# EasyEDA schematic SCH_pcb555_2024-04-26.json
TITLE: PCB_555_LED_chaser; REV: 1.0; Date: 2024-04-22; Sheet: 1/1; Drawn By: dimir; Company: Your Company
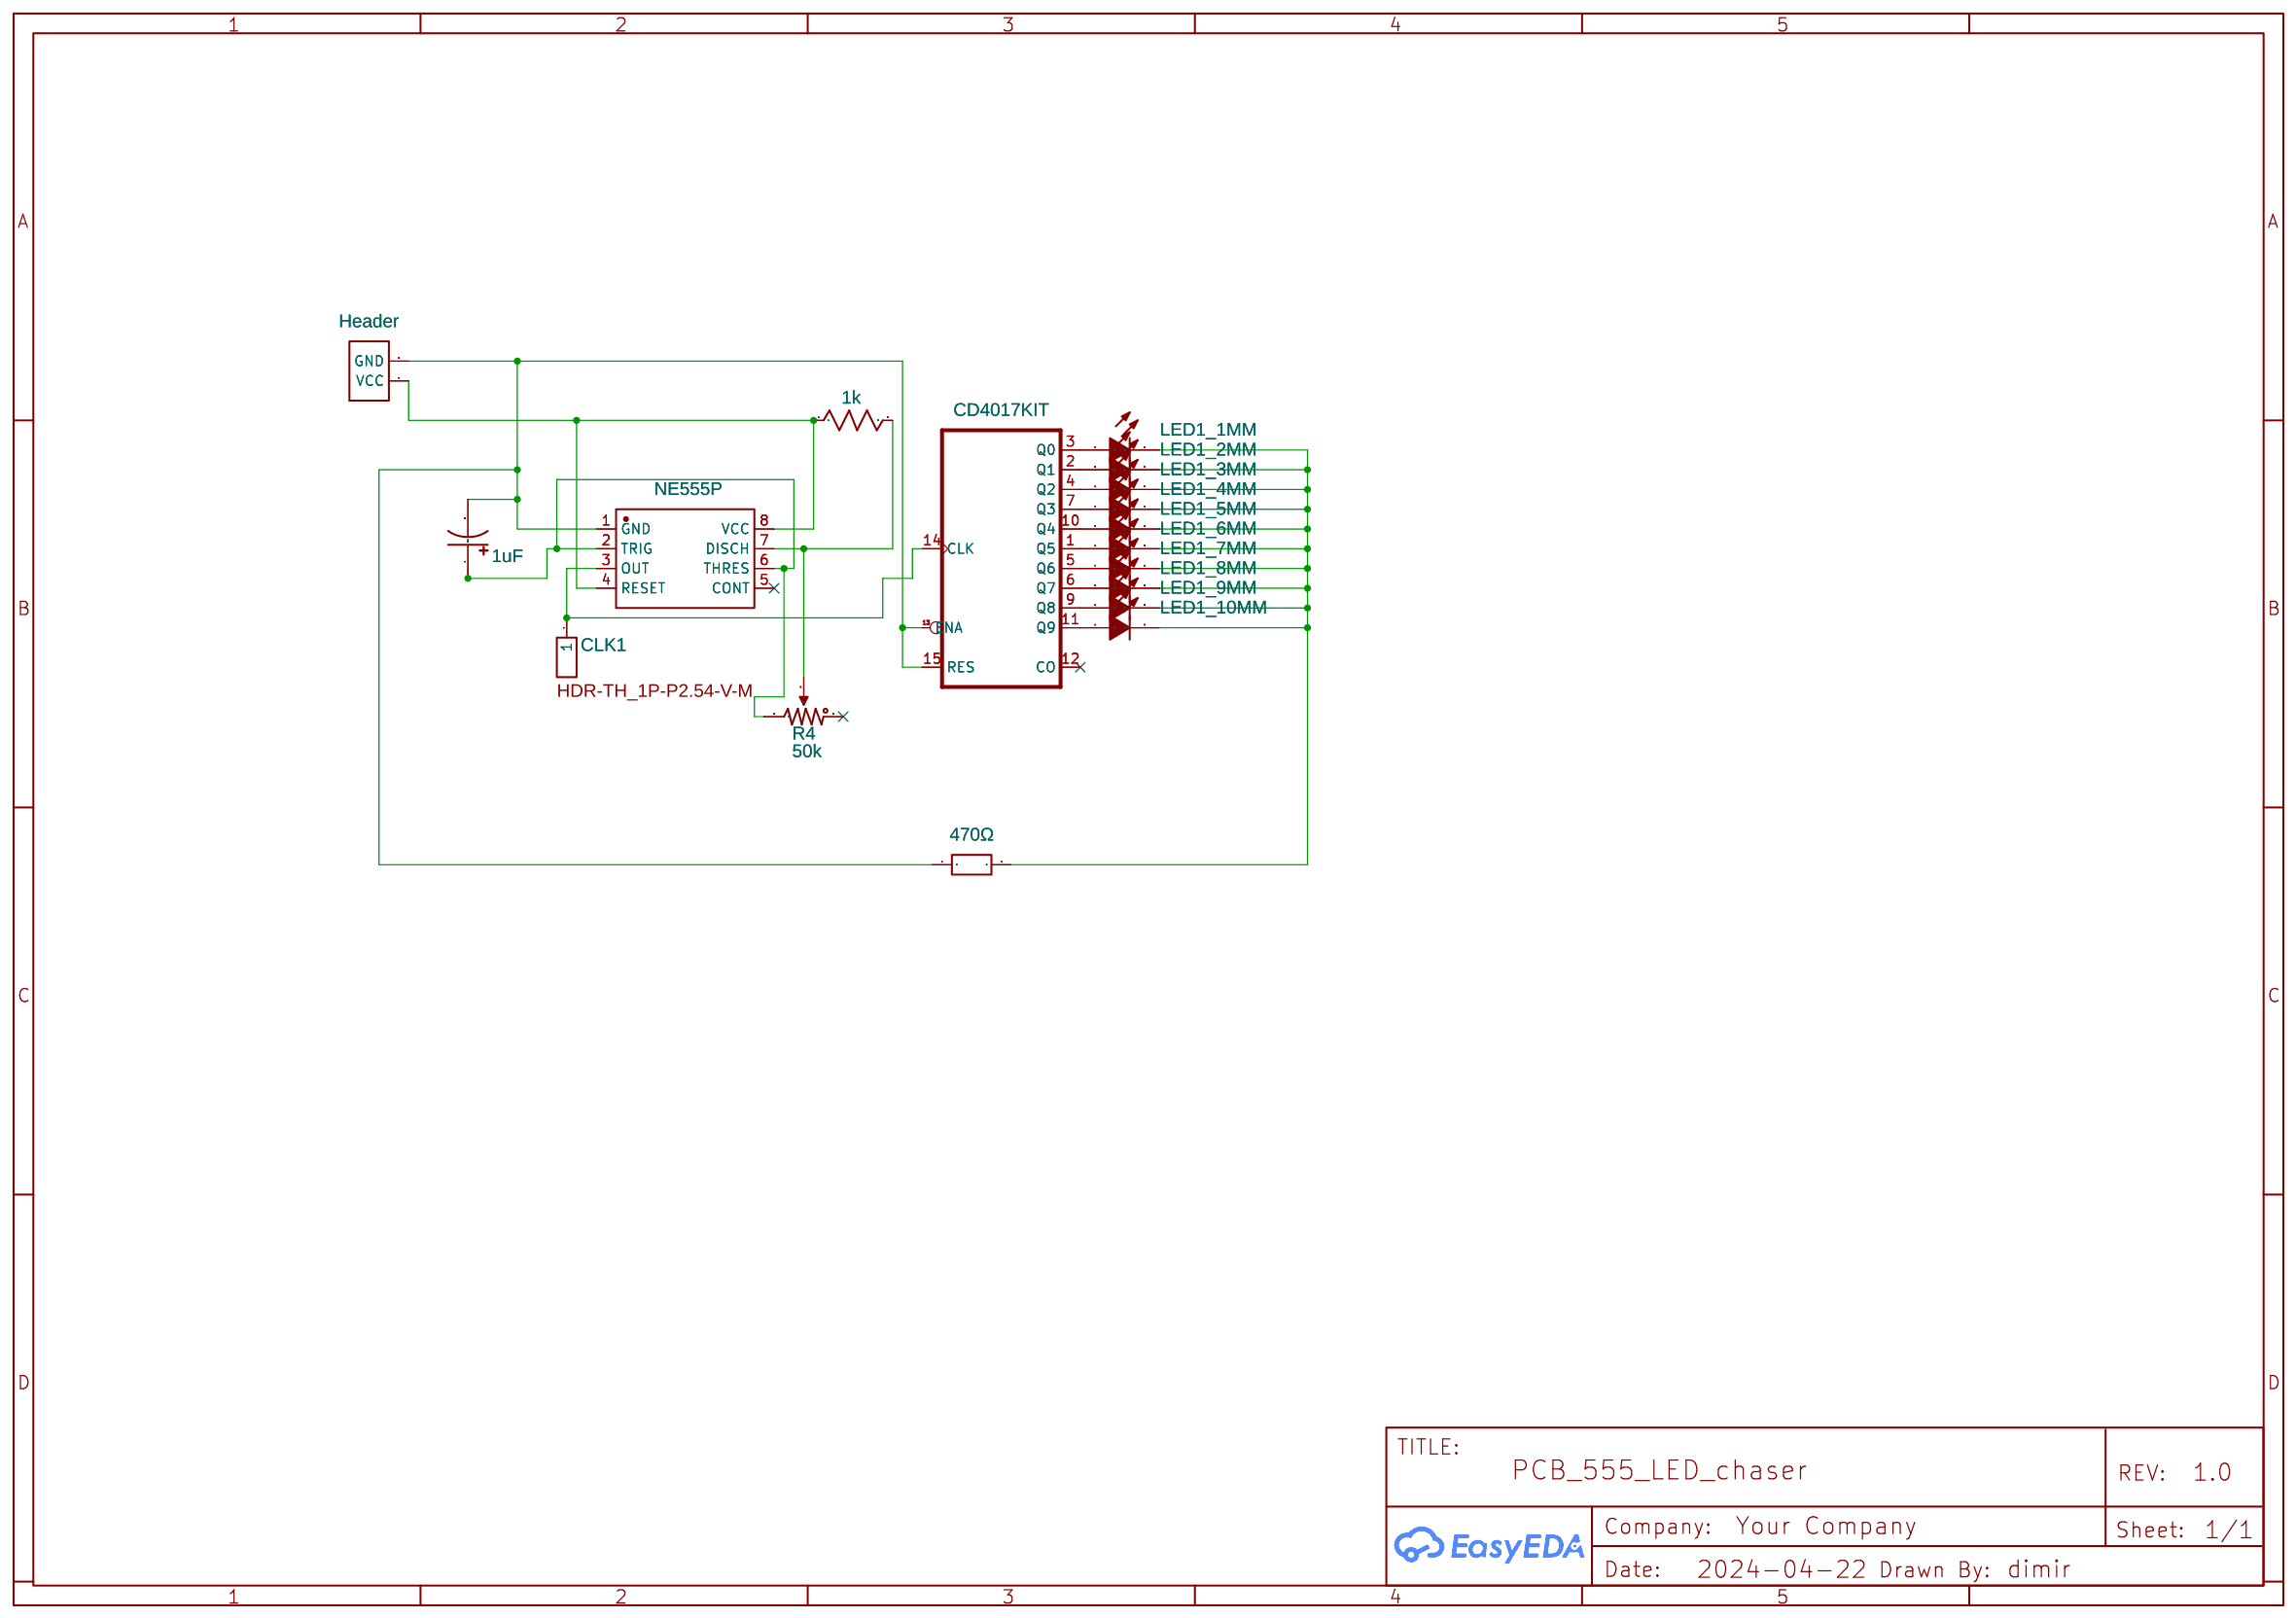
[diagram p0: schematic sheet]

## Parts
C1  1uF  [CAP-TH_BD5.0-P2.00-D0.8-FD]
CLK1  C81276  [HDR-TH_1P-P2.54-V-M]
H1  Header  [HEADER-FEMALE-2.54_1X2]
LED1_1MM  LED_5MM  [LED-TH_BD5.0-P2.54-FD_C9900023552]
LED1_2MM  LED_5MM  [LED-TH_BD5.0-P2.54-FD_C9900023552]
LED1_3MM  LED_5MM  [LED-TH_BD5.0-P2.54-FD_C9900023552]
LED1_4MM  LED_5MM  [LED-TH_BD5.0-P2.54-FD_C9900023552]
LED1_5MM  LED_5MM  [LED-TH_BD5.0-P2.54-FD_C9900023552]
LED1_6MM  LED_5MM  [LED-TH_BD5.0-P2.54-FD_C9900023552]
LED1_7MM  LED_5MM  [LED-TH_BD5.0-P2.54-FD_C9900023552]
LED1_8MM  LED_5MM  [LED-TH_BD5.0-P2.54-FD_C9900023552]
LED1_9MM  LED_5MM  [LED-TH_BD5.0-P2.54-FD_C9900023552]
LED1_10MM  LED_5MM  [LED-TH_BD5.0-P2.54-FD_C9900023552]
R2  1k  [AXIAL-0.3]
R4  50k  [RES-ADJ_3296X]
U1  CD4017KIT  [DIL16-KIT]  (section 1)
U2  NE555P  [DIP-8_L9.8-W6.6-P2.54-LS7.6-BL]
U3  470Ω  [RES-TH_BD3.3-L9.0-P13.00-D0.6]

## Library data of the parts
C1 = UVZ1H010MDD: Contributor: LCSC; Supplier: LCSC; Supplier Part: C62934; Manufacturer: Nichicon(尼吉康)
CLK1 = Header-Male-2.54_1x1: Supplier: LCSC; Manufacturer Part: 2.54-1*1P针; JLCPCB Part Class: Extended Part; Package Display: Yes; Manufacturer: BOOMELE(Boom Precision Elec); Contributor: Thejo Prakash
H1 = HEADER-FEMALE-2.54_1X2: Contributor: nonstop2004; Supplier Part: C492401; Supplier: LCSC
LED1_1MM LED1_2MM LED1_3MM LED1_4MM LED1_5MM LED1_6MM LED1_7MM LED1_8MM LED1_9MM LED1_10MM = LED_5MM: Contributor: lcsc; Supplier: LCSC; Supplier Part: C2992663
R2 = Resistor: Manufacturer Part: ?; Supplier Part: C713997; Supplier: LCSC
R4 = Potentiometer: K(%): 50; Manufacturer Part: ?; Supplier Part: C118912; Supplier: LCSC
U1 = CD4017KIT: Contributor: SparkFun; Supplier Part: C34519
U2 = NE555P: Supplier: LCSC; Manufacturer: TI(德州仪器); Supplier Part: C46749; JLCPCB Part Class: Extended Part
U3 = RSF-50JT-52-470R: Contributor: lcsc; Supplier: LCSC; Supplier Part: C58592; Manufacturer: YAGEO(国巨)

## Nets
Net-(C1-1): C1.1 R4.1 U2.2(TRIG) U2.6(THRES)
Net-(C1-2): C1.2 H1.2(GND) U1.13(ENA) U1.15(RES) U2.1(GND) U3.1
Net-(CLK1-1): CLK1.1 U1.14(CLK) U2.3(OUT)
Net-(H1-1): H1.1(VCC) R2.1 U2.4(RESET) U2.8(VCC)
Net-(LED1_1MM-1): LED1_1MM.1(A) U1.3(Q0)
Net-(LED1_1MM-2): LED1_1MM.2(K) LED1_2MM.2(K) LED1_3MM.2(K) LED1_4MM.2(K) LED1_5MM.2(K) LED1_6MM.2(K) LED1_7MM.2(K) LED1_8MM.2(K) LED1_9MM.2(K) LED1_10MM.2(K) U3.2
Net-(LED1_2MM-1): LED1_2MM.1(A) U1.2(Q1)
Net-(LED1_3MM-1): LED1_3MM.1(A) U1.4(Q2)
Net-(LED1_4MM-1): LED1_4MM.1(A) U1.7(Q3)
Net-(LED1_5MM-1): LED1_5MM.1(A) U1.10(Q4)
Net-(LED1_6MM-1): LED1_6MM.1(A) U1.1(Q5)
Net-(LED1_7MM-1): LED1_7MM.1(A) U1.5(Q6)
Net-(LED1_8MM-1): LED1_8MM.1(A) U1.6(Q7)
Net-(LED1_9MM-1): LED1_9MM.1(A) U1.9(Q8)
Net-(LED1_10MM-1): LED1_10MM.1(A) U1.11(Q9)
Net-(R2-2): R2.2 R4.2(3) U2.7(DISCH)

Not connected (* = marked no-connect by the designer): R4 3(2)*; U1 12(CO)*; U2 5(CONT)*
